# EAGLE design DC_Driver (EAGLE 7.2.0)
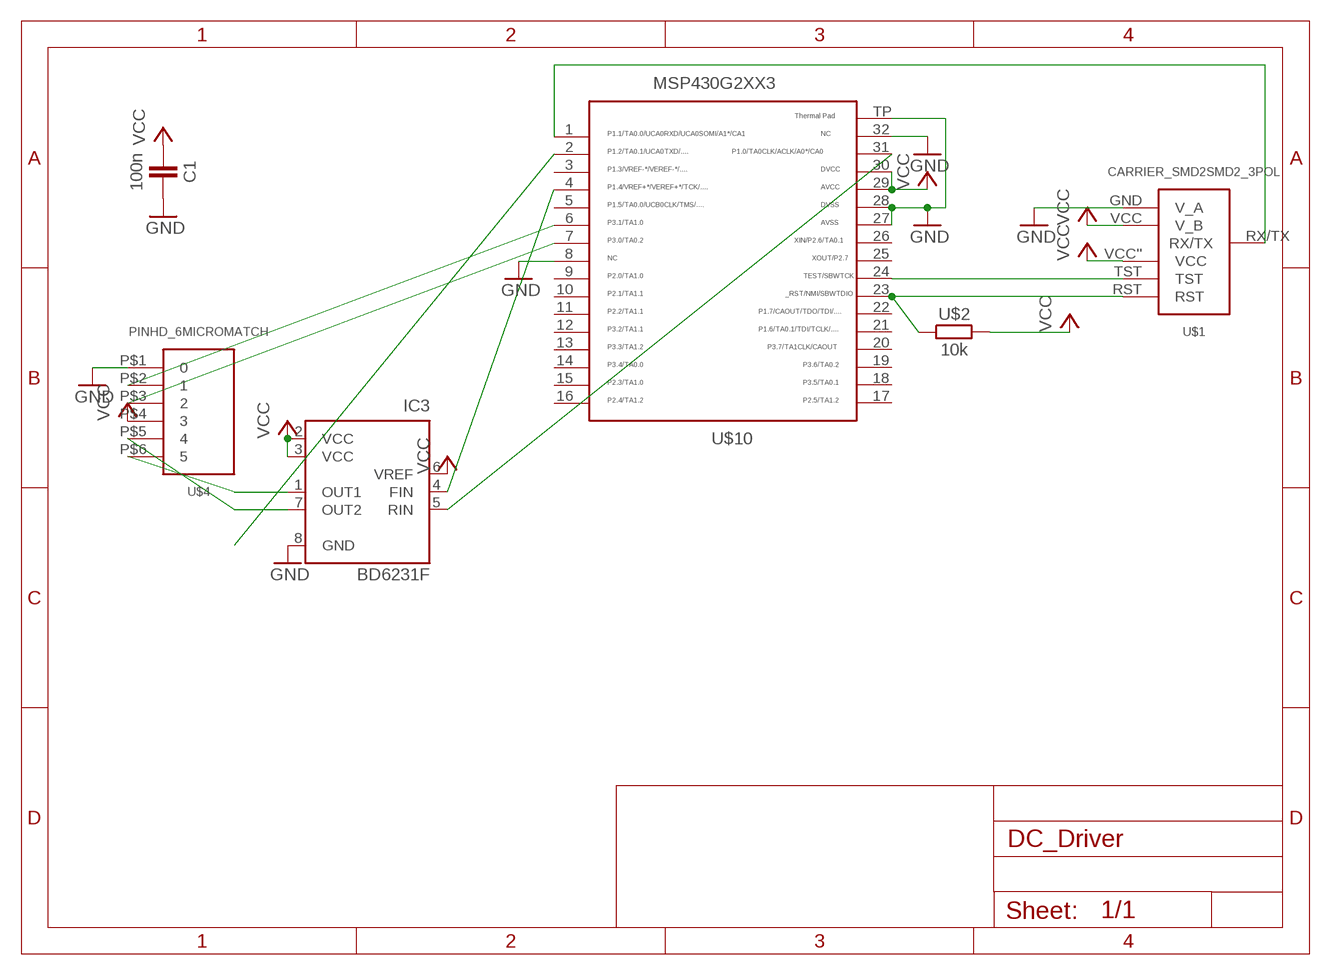
[diagram p0: schematic, sheet 1]

## Parts
C1  100n  CAPACITOR  [603]
IC3  BD6231F  [SOP8]
U$1  CARRIER_SMD2SMD2_3POL  [CARRIER_SMD2_3POL]
U$2  10k  RESISTOR0603  [603]
U$4  PINHD_6MICROMATCH  [MICROMATCH6POL]
U$10  MSP430G2553  [QFN32]

## Nets
GND: C1.2 IC3.8(GND) U$1.GND(V_A) U$4.P$1 U$10.8 U$10.27 U$10.28 U$10.32 U$10.TP
N$2: IC3.7(OUT2) U$4.P$5
N$3: U$1.TST U$10.24
N$4: U$1.RST U$2.1 U$10.23
N$5: IC3.1(OUT1) U$4.P$6
N$6: IC3.4(FIN) U$10.4
N$7: IC3.5(RIN) U$10.31
N$11: U$10.2
N$12: U$1.RX/TX U$10.1
N$13: U$4.P$2 U$10.6
N$14: U$4.P$3 U$10.7
VCC: C1.1 IC3.2(VCC) IC3.3(VCC) IC3.6(VREF) U$1.VCC''(VCC) U$1.VCC(V_B) U$2.2 U$4.P$4 U$10.29 U$10.30
Unconnected: U$10.3 U$10.5 U$10.9 U$10.10 U$10.11 U$10.12 U$10.13 U$10.14 U$10.15 U$10.16 U$10.17 U$10.18 U$10.19 U$10.20 U$10.21 U$10.22 U$10.25 U$10.26

## Library data of the parts
C1 = thar:CAPACITOR
IC3 = rohm:BD623*F: H-bridge driver for brush motors Source: http://www.rohm.com/products/databook/motor/pdf/bd623x_series-e.pdf; MPN: BD6231F-E2; OC_FARNELL: 1716265; OC_NEWARK: 15R0530
U$1 = thar:CARRIER_SMD2
U$2 = thar:RESISTOR
U$4 = thar:PINHD_6
U$10 = thar:MSP430G2553: TEXAS INSTRUMENTS MSP430G2553IRHB32R MCU, 16BIT, MSP430, 16MHZ, QFN-32 Farnell Best.Nr.: 2325726 Herst.Bez.: MSP430G2553IRHB32R

## Board
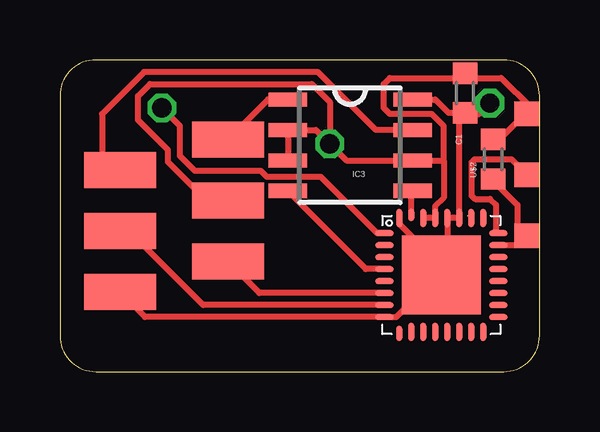
[diagram p1: board, top side]
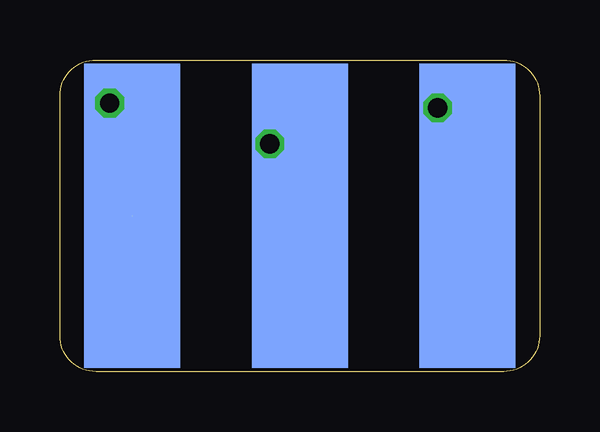
[diagram p2: board, bottom side, seen from below]

Size 20 x 13 mm. Coordinates in mm from the lower left corner, seen from the top.
Copper layers (1*16): Top 0.035mm / dielectric 1.5mm / Bottom 0.035mm
Design rules "Bilex DRU *": minimum track width 10mil, minimum drill 24mil, track to track 10mil, track to pad 10mil, pad to pad 10mil, via to via 10mil, smd to smd 10mil, copper to edge 1mil, drill to drill 8mil, minimum pad ring 10mil, minimum via ring 8mil, stop-mask expansion 4mil, vias tented up to drill 0mil, thermal gap 10mil

### Footprints (pad centres in the part's own frame; a part is rotated, then mirrored left to right if it is on the bottom)
603 = smd 0.889 x 1.016: 1 -0.826,0; 2 0.826,0
SOP8 = smd 0.6 x 1.6: 1 -1.905,-2.6; 2 -0.635,-2.6; 3 0.635,-2.6; 4 1.905,-2.6; 5 1.905,2.6; 6 0.635,2.6; 7 -0.635,2.6; 8 -1.905,2.6
CARRIER_SMD2_3POL = smd 4 x 12.7 bottom: GND -6.985,0; RX/TX 6.985,0; VCC 0,0 | smd 1.016 x 1.016: RST -9.461,0.826; TST -9.461,-1.714; VCC'' -9.461,-4.255
MICROMATCH6POL = smd 1.5 x 3: P$1 -3.175,2.25; P$2 -1.905,-2.25; P$3 -0.635,2.25; P$4 0.635,-2.25; P$5 1.905,2.25; P$6 3.175,-2.25
QFN32 = smd 0.762 x 0.254: 1 -2.375,1.75; 2 -2.375,1.25; 3 -2.375,0.75; 4 -2.375,0.25; 5 -2.375,-0.25; 6 -2.375,-0.75; 7 -2.375,-1.25; 8 -2.375,-1.75; 17 2.375,-1.75; 18 2.375,-1.25; 19 2.375,-0.75; 20 2.375,-0.25; 21 2.375,0.25; 22 2.375,0.75; 23 2.375,1.25; 24 2.375,1.75 | smd 0.254 x 0.635: 9 -1.75,-2.438 | smd 0.254 x 0.762: 10 -1.25,-2.375; 11 -0.75,-2.375; 12 -0.25,-2.375; 13 0.25,-2.375; 14 0.75,-2.375; 15 1.25,-2.375; 16 1.75,-2.375; 25 1.75,2.375; 26 1.25,2.375; 27 0.75,2.375; 28 0.25,2.375; 29 -0.25,2.375; 30 -0.75,2.375; 32 -1.75,2.375 | smd 0.254 x 0.508: 31 -1.25,2.5 | smd 3.302 x 3.302: TP 0,0

### Placement (x,y rotation side)
C1  16.89,11.61 270 top
IC3  12.1,9.44 270 top
U$1  10,6.5 180 top
U$2  18.06,8.86 90 top
U$4  4.75,6.5 90 top
U$10  15.9,4.03 0 top

### Tracks (layer width: path | path; a pad name or v marks a point on that pad's centre or on a via)
GND  (via drill 0.8)  (1 unrouted)
  Top 0.254: 16.43,4.35 16.19,5.38 16.16,5.35 | 16.43,4.35 16.48,3.06 U$10.TP 15.01,2.94 14.89,3.14 14.03,2.28 U$10.8 3.54,2.28 U$4.P$1 | U$10.32 14.15,6.16 14.76,5.55 15.52,5.35 16.15,4.72 | 16.15,4.72 U$10.28 U$10.27 16.65,10.55 | 16.15,4.72 16.15,4.42 16.43,4.35 | 17.88,11.39 v17.93,11.2 17.48,10.75 16.75,10.75 16.95,10.55 | 16.65,10.55 C1.2 16.21,10.79 15.66,11.34 IC3.8 | 16.65,10.55 16.95,10.55 | 17.04,10.55 16.95,10.55
  Bottom 0.254: 17.62,6.5 17.81,6.56 v17.93,11.2 17.05,6.55 17,6.5
N$2
  Top 0.254: IC3.7 13.18,10.07 10.75,12.5 3.5,12.5 1.75,10.75 1.75,8.4 U$4.P$5
N$3
  Top 0.254: 19.61,7.88 19.46,8.02 19.5,8.18 | U$10.24 18.19,5.78 18.19,6.95 17.93,7.21 17.3,7.21 17.17,7.33 17.17,8.73 17.3,8.86 18.82,8.86 19.5,8.18 | 19.5,8.18 19.46,8.18 U$1.TST
N$4
  Top 0.254: 19.46,5.48 19.5,5.38 | 19.46,5.48 19.5,5.69 19.33,5.71 | 19.33,5.71 19.08,5.74 19.08,6.95 18.06,7.97 U$2.1 | U$10.23 19.28,5.28 19.46,5.48 | U$1.RST 19.33,5.67 19.33,5.71
N$5
  Top 0.254: IC3.1 8.67,11.34 U$4.P$6
N$6
  Top 0.254: U$10.4 12.75,4.28 IC3.4
N$7
  Top 0.254: U$10.31 14.65,7.49 IC3.5
N$12  (via drill 0.8)
  Top 0.254: U$10.1 13.22,5.78 10.88,8.12 8.62,8.12 8.38,8.38 5.62,8.38 5,9 5,10.25 v4.25,11
  Bottom 0.254: U$1.RX/TX v4.25,11 1.75,6.5
N$13
  Top 0.254: U$10.6 8.31,3.28 U$4.P$2
N$14
  Top 0.254: U$10.7 5.97,2.78 3,5.75 2.62,5.75 U$4.P$3
VCC  (via drill 0.8)
  Top 0.254: U$10.30 U$10.29 15.65,6.9 16,7.25 16,8.8 | 19.5,10.52 19.46,10.56 | U$2.2 18.12,9.48 19.2,10.56 19.2,10.51 19.46,10.56 | 19.65,10.76 19.65,10.75 19.46,10.56 | U$1.VCC'' 19.65,10.76 | 19.65,10.76 19.65,11.01 18.41,12.25 17,12.25 16.89,12.36 C1.1 16.7,12.25 13.75,12.25 13.5,12 13.5,11 13.75,10.75 15.5,10.75 16,10.25 16,8.8 | 16,8.8 IC3.6 11.95,8.8 v11.25,9.5 | IC3.3 IC3.2 10.68,10.07 v11.25,9.5 | 7.62,7.13 U$4.P$4 6.12,7.13 4.5,8.75 4.5,9.25 3.25,10.5 3.25,11.5 3.75,12 10.5,12 11.25,11.25 v11.25,9.5
  Bottom 0.254: U$1.VCC 11.5,8 v11.25,9.5 10,8.25 10,4.75